# Altium schematic sheet MAIN.SchDoc
size A2; SheetNumber: 1; SheetTotal: 16
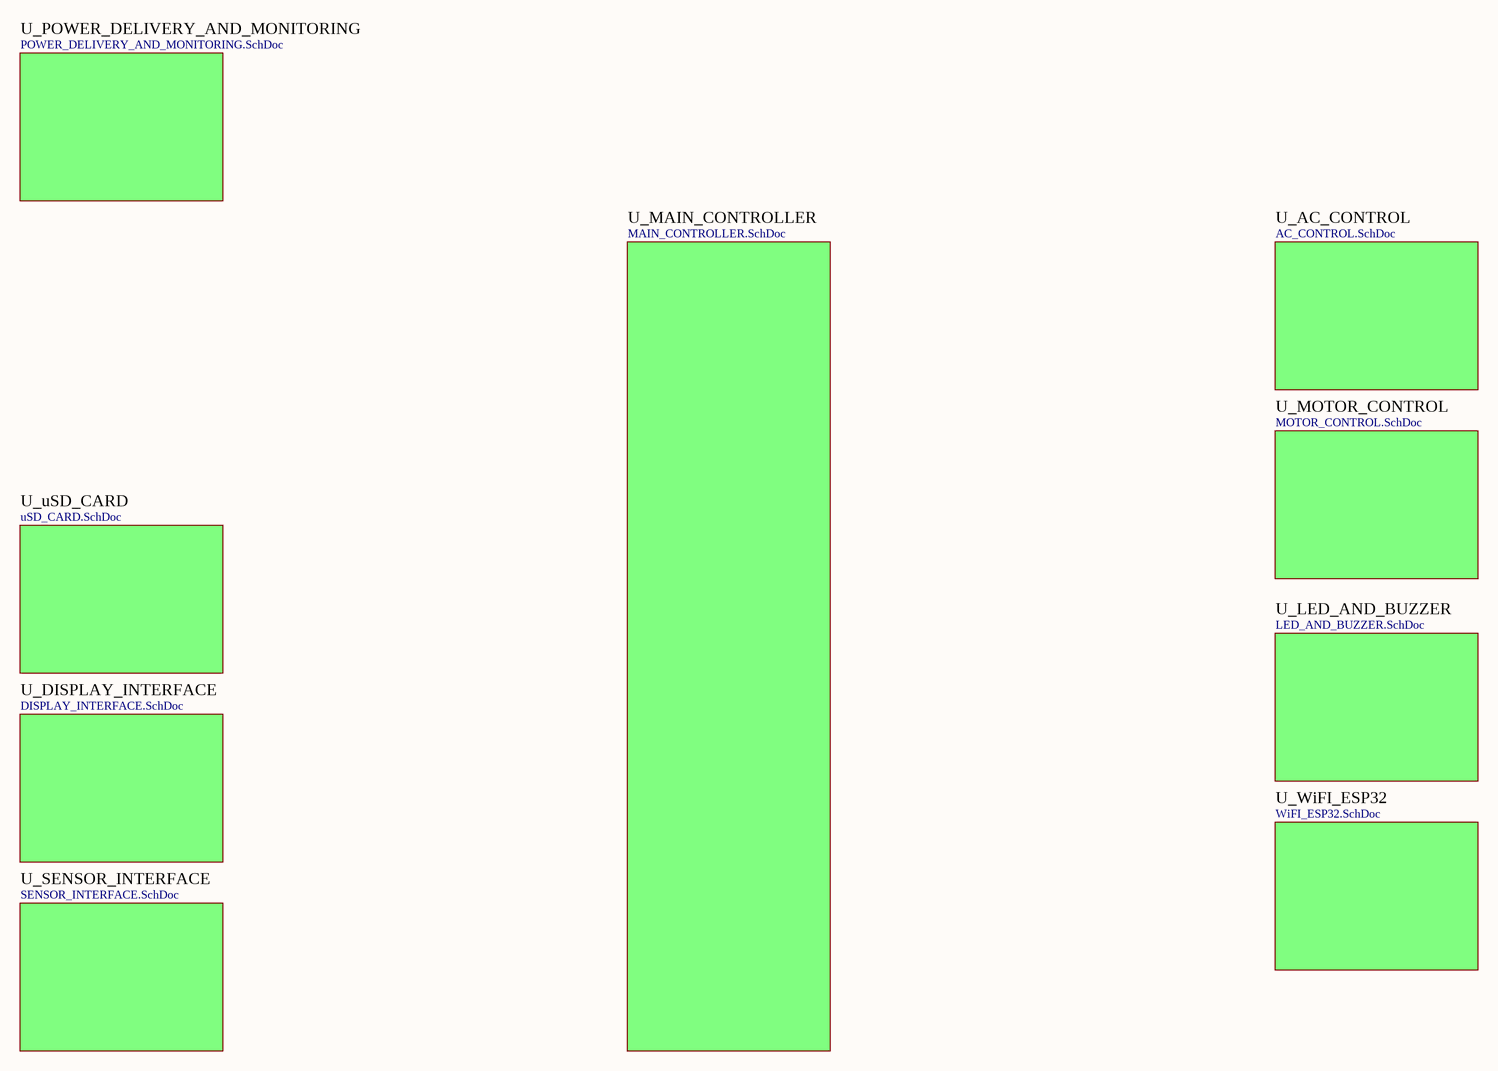
[diagram p0: MAIN.SchDoc]

## Sub-sheets
U_AC_CONTROL = AC_CONTROL.SchDoc: no entries
U_DISPLAY_INTERFACE = DISPLAY_INTERFACE.SchDoc: no entries
U_LED_AND_BUZZER = LED_AND_BUZZER.SchDoc: no entries
U_MAIN_CONTROLLER = MAIN_CONTROLLER.SchDoc: no entries
U_MOTOR_CONTROL = MOTOR_CONTROL.SchDoc: no entries
U_POWER_DELIVERY_AND_MONITORING = POWER_DELIVERY_AND_MONITORING.SchDoc: no entries
U_SENSOR_INTERFACE = SENSOR_INTERFACE.SchDoc: no entries
U_uSD_CARD = uSD_CARD.SchDoc: no entries
U_WiFI_ESP32 = WiFI_ESP32.SchDoc: no entries